# EAGLE design ldrboard (EAGLE 6.5.0)
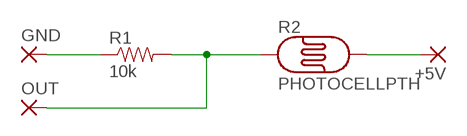
[diagram p0: schematic, sheet 1]

## Parts
+5V  2,54/1,1  [2,54/1,1]
GND  2,54/1,1  [2,54/1,1]
OUT  2,54/1,1  [2,54/1,1]
R1  10k  10KOHM-1/4W-1%(PTH)HORIZ  [AXIAL-0.3]
R2  PHOTOCELLPTH  [PHOTOCELL]

## Nets
N$1: OUT.1(P) R1.P$2 R2.1
N$2: GND.1(P) R1.P$1
N$3: +5V.1(P) R2.2

## Library data of the parts
+5V GND OUT = wirepad:2,54/1,1: THROUGH-HOLE PAD
R1 = SparkFun-Resistors:10KOHM-1/4W-1%(PTH): RES-12183; PROD_ID: RES-12183
R2 = SparkFun-Sensors:PHOTOCELL: CdS photoresistor. This is a low cost way to detect light levels. Resistance decreases with more incoming light. SparkFun SKU: SEN-09088

## Board
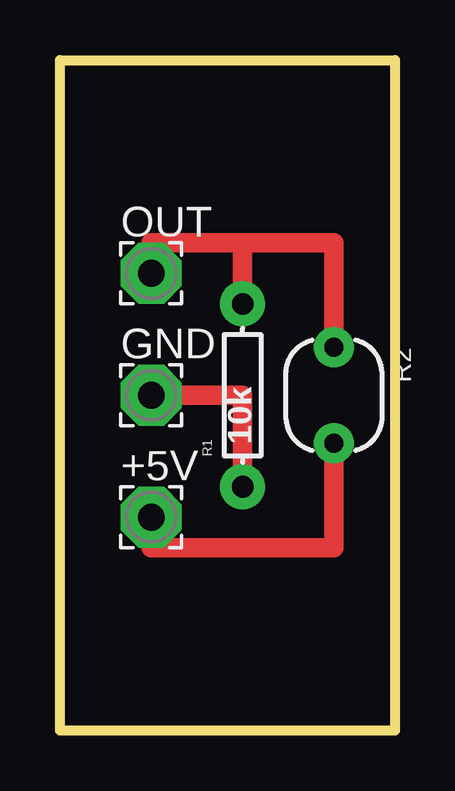
[diagram p1: board, top side]

Size 13.97 x 27.94 mm. Coordinates in mm from the lower left corner, seen from the top.
Outline: 0,0 0,27.94 13.97,27.94 13.97,0 0,0
Copper layers (1*16): Top 0.035mm / dielectric 1.5mm / Bottom 0.035mm
Design rules "default": minimum track width 10mil, minimum drill 24mil, track to track 8mil, track to pad 8mil, pad to pad 8mil, via to via 8mil, smd to smd 8mil, copper to edge 40mil, drill to drill 8mil, minimum pad ring 10mil, minimum via ring 8mil, stop-mask expansion 4mil, vias tented up to drill 0mil, thermal gap 10mil

### Footprints (pad centres in the part's own frame; a part is rotated, then mirrored left to right if it is on the bottom)
2,54/1,1 = drill 1.118 pad 2.54 octagon: 1 0,0
AXIAL-0.3 = drill 0.9 pad 1.88: P$1 -3.81,0; P$2 3.81,0
PHOTOCELL = drill 0.8 pad 1.676: 1 -2,0; 2 2,0

### Placement (x,y rotation side)
+5V  3.81,8.89 0 top
GND  3.81,13.97 0 top
OUT  3.81,19.05 0 top
R1  7.62,13.97 90 top
R2  11.43,13.97 270 top

### Tracks (layer width: path | path; a pad name or v marks a point on that pad's centre or on a via)
N$1
  Top 0.813: OUT.1 3.81,20.32 7.62,20.32 | 7.62,20.32 R1.P$2 | R2.1 11.43,20.32 7.62,20.32
N$2
  Top 0.813: GND.1 7.62,13.97 R1.P$1
N$3
  Top 0.813: +5V.1 3.81,7.62 11.43,7.62 R2.2